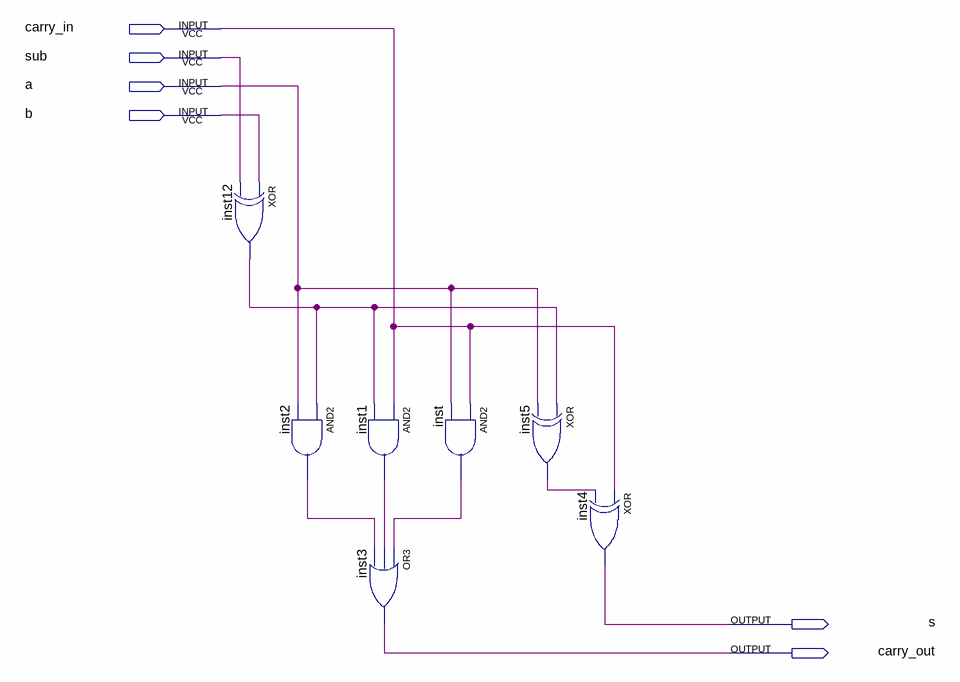
[diagram p0: schematic sheet]
// Quartus schematic tfa.bdf as structural Verilog: 7 symbols, 6 pins
module tfa (
  input  carry_in,
  input  sub,
  input  a,
  input  b,
  output s,
  output carry_out
);

  wire inst1_out, inst2_out, inst5_out, inst12_out, inst_out;

  xor inst12 (inst12_out, b, sub);
  and inst2 (inst2_out, inst12_out, a);
  and inst1 (inst1_out, carry_in, inst12_out);
  or inst3 (carry_out, inst_out, inst1_out, inst2_out);
  and inst (inst_out, carry_in, a);
  xor inst5 (inst5_out, inst12_out, a);
  xor inst4 (s, carry_in, inst5_out);
endmodule
